# Altium schematic sheet 14-I225-Main.SchDoc
size A; SheetNumber: 14; SheetTotal: 16
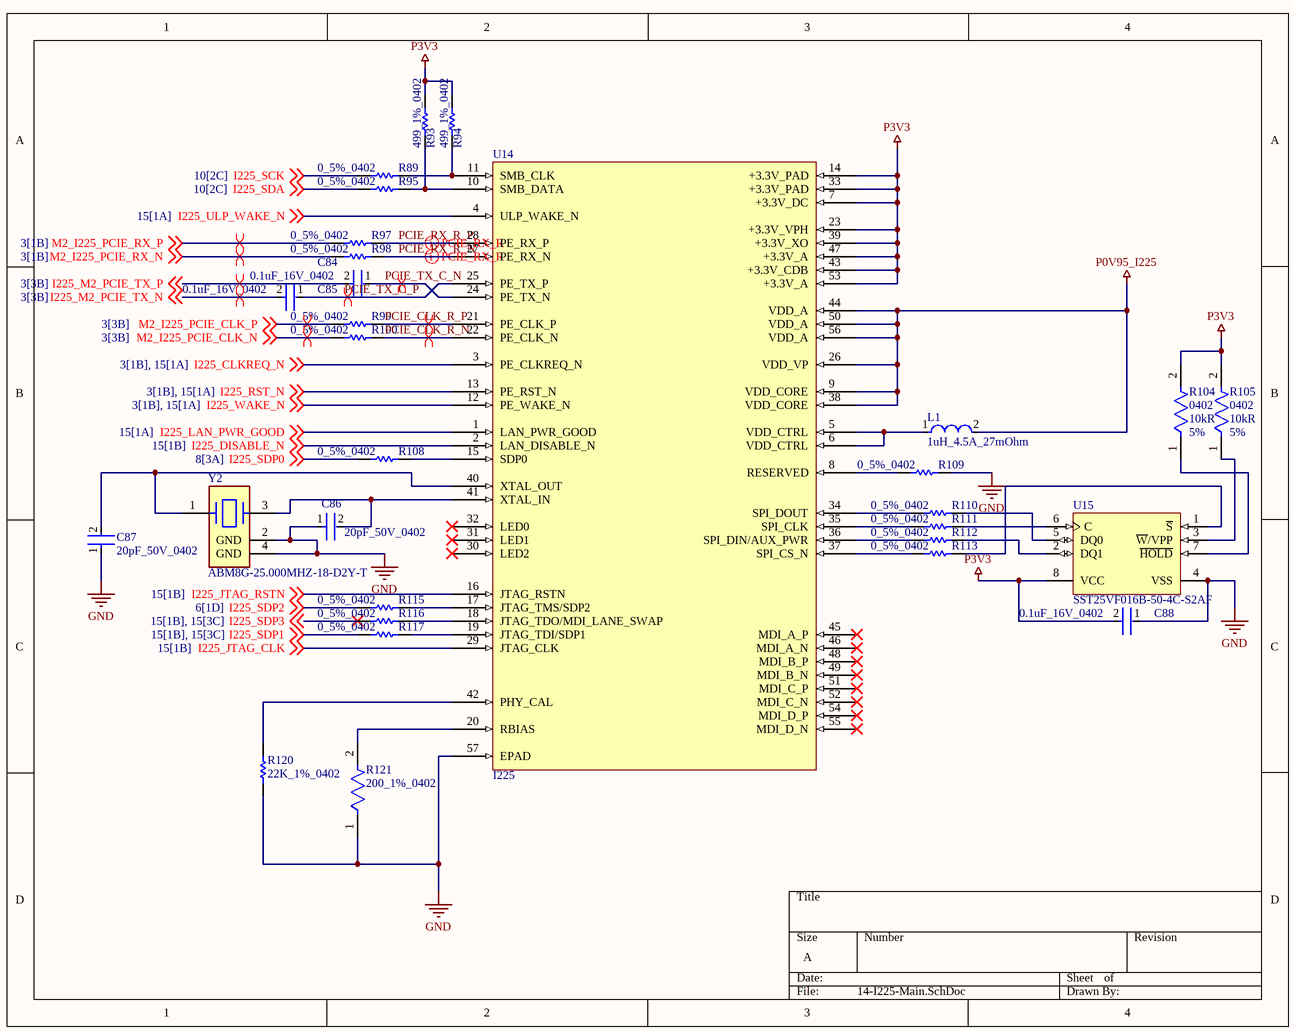
[diagram p0: 14-I225-Main.SchDoc]

## Parts
C84  0.1uF_16V_0402  [FP-GRM15-MFG]
C85  0.1uF_16V_0402  [FP-GRM15-MFG]
C86  20pF_50V_0402  [FP-C0402-BB-MFG]
C87  20pF_50V_0402  [FP-C0402-BB-MFG]
C88  0.1uF_16V_0402  [FP-GRM15-MFG]
L1  1uH_4.5A_27mOhm  [FP-IHLP-1616BZ-FP_1_8545x-MFG]
R89  0_5%_0402  [RESC1005X40X25LL10T10]
R93  499_1%_0402  [RESC1005X40X25LL05T05]
R94  499_1%_0402  [RESC1005X40X25LL05T05]
R95  0_5%_0402  [RESC1005X40X25LL10T10]
R97  0_5%_0402  [RESC1005X40X25LL10T10]
R98  0_5%_0402  [RESC1005X40X25LL10T10]
R99  0_5%_0402  [RESC1005X40X25LL10T10]
R100  0_5%_0402  [RESC1005X40X25LL10T10]
R104  Case/Package: 0402  Resistance: 10kR  Tolerance: 5%  [FP-CRCW0402-e3-IPC_B]  (hidden comment: CRCW040210K0JNED)
R105  Case/Package: 0402  Resistance: 10kR  Tolerance: 5%  [FP-CRCW0402-e3-IPC_B]  (hidden comment: CRCW040210K0JNED)
R108  0_5%_0402  [RESC1005X40X25LL10T10]
R109  0_5%_0402  [RESC1005X40X25LL10T10]
R110  0_5%_0402  [RESC1005X40X25LL10T10]
R111  0_5%_0402  [RESC1005X40X25LL10T10]
R112  0_5%_0402  [RESC1005X40X25LL10T10]
R113  0_5%_0402  [RESC1005X40X25LL10T10]
R115  0_5%_0402  [RESC1005X40X25LL10T10]
R116  0_5%_0402  [RESC1005X40X25LL10T10]
R117  0_5%_0402  [RESC1005X40X25LL10T10]
R120  22K_1%_0402  [RESC1005X40X25NL05T05]
R121  200_1%_0402  [FP-CRCW0402-e3-IPC_C]
U14  I225  [I225 QFN56]
U15  SST25VF016B-50-4C-S2AF  [MICT-MW-8_N]
Y2  ABM8G-25.000MHZ-18-D2Y-T  [FP-ABM8G-MFG]

## Nets
GND: C86.1 C87.1 C88.1 R109.2 R120.1 R121.1 U14.57(EPAD) U15.4(VSS) Y2.2(GND) Y2.4(GND)
P0V95_I225: L1.2 U14.9(VDD_CORE) U14.26(VDD_VP) U14.38(VDD_CORE) U14.44(VDD_A) U14.50(VDD_A) U14.56(VDD_A)
P3V3: C88.2 R93.2 R94.2 R104.2 R105.2 U14.7(+3.3V_DC) U14.14(+3.3V_PAD) U14.23(+3.3V_VPH) U14.33(+3.3V_PAD) U14.39(+3.3V_XO) U14.43(+3.3V_CDB) U14.47(+3.3V_A) U14.53(+3.3V_A) U15.8(VCC)
I225_CLKREQ_N: U14.3(PE_CLKREQ_N) ; off-sheet I225_CLKREQ_N
I225_DISABLE_N: U14.2(LAN_DISABLE_N) ; off-sheet I225_DISABLE_N
I225_JTAG_CLK: U14.29(JTAG_CLK) ; off-sheet I225_JTAG_CLK
I225_JTAG_RSTN: U14.16(JTAG_RSTN) ; off-sheet I225_JTAG_RSTN
I225_LAN_PWR_GOOD: U14.1(LAN_PWR_GOOD) ; off-sheet I225_LAN_PWR_GOOD
I225_M2_PCIE_TX_N: C85.2 ; off-sheet I225_M2_PCIE_TX_N
I225_M2_PCIE_TX_P: C84.2 ; off-sheet I225_M2_PCIE_TX_P
I225_RST_N: U14.13(PE_RST_N) ; off-sheet I225_RST_N
I225_SCK: R89.1 ; off-sheet I225_SCK
I225_SDA: R95.1 ; off-sheet I225_SDA
I225_SDP0: R108.1 ; off-sheet I225_SDP0
I225_SDP1: R117.1 ; off-sheet I225_SDP1
I225_SDP2: R115.1 ; off-sheet I225_SDP2
I225_SDP3: R116.1 ; off-sheet I225_SDP3
I225_ULP_WAKE_N: U14.4(ULP_WAKE_N) ; off-sheet I225_ULP_WAKE_N
I225_WAKE_N: U14.12(PE_WAKE_N) ; off-sheet I225_WAKE_N
M2_I225_PCIE_CLK_N: R100.1 ; off-sheet M2_I225_PCIE_CLK_N
M2_I225_PCIE_CLK_P: R99.1 ; off-sheet M2_I225_PCIE_CLK_P
M2_I225_PCIE_RX_N: R98.1 ; off-sheet M2_I225_PCIE_RX_N
M2_I225_PCIE_RX_P: R97.1 ; off-sheet M2_I225_PCIE_RX_P
PCIE_CLK_R_N: R100.2 U14.22(PE_CLK_N)
PCIE_CLK_R_P: R99.2 U14.21(PE_CLK_P)
PCIE_RX_R_N: R98.2 U14.27(PE_RX_N)
PCIE_RX_R_P: R97.2 U14.28(PE_RX_P)
PCIE_TX_C_N: C84.1 U14.24(PE_TX_N)
PCIE_TX_C_P: C85.1 U14.25(PE_TX_P)
NetC86_2: C86.2 U14.41(XTAL_IN) Y2.3
NetC87_2: C87.2 U14.40(XTAL_OUT) Y2.1
NetL1_1: L1.1 U14.5(VDD_CTRL) U14.6(VDD_CTRL)
NetR89_2: R89.2 R94.1 U14.11(SMB_CLK)
NetR93_1: R93.1 R95.2 U14.10(SMB_DATA)
NetR104_1: R104.1 U15.7(~{HOLD})
NetR105_1: R105.1 U15.3(~{W}/VPP)
NetR108_2: R108.2 U14.15(SDP0)
NetR109_1: R109.1 U14.8(RESERVED)
NetR110_1: R110.1 U14.34(SPI_DOUT)
NetR110_2: R110.2 U15.5(DQ0)
NetR111_1: R111.1 U14.35(SPI_CLK)
NetR111_2: R111.2 U15.6(C)
NetR112_1: R112.1 U14.36(SPI_DIN/AUX_PWR)
NetR112_2: R112.2 U15.2(DQ1)
NetR113_1: R113.1 U14.37(SPI_CS_N)
NetR113_2: R113.2 U15.1(~{S})
NetR115_2: R115.2 U14.17(JTAG_TMS/SDP2)
NetR116_2: R116.2 U14.18(JTAG_TDO/MDI_LANE_SWAP)
NetR117_2: R117.2 U14.19(JTAG_TDI/SDP1)
NetR120_2: R120.2 U14.42(PHY_CAL)
NetR121_2: R121.2 U14.20(RBIAS)

Not connected (* = marked no-connect by the designer): U14 30(LED2)* 31(LED1)* 32(LED0)* 45(MDI_A_P)* 46(MDI_A_N)* 48(MDI_B_P)* 49(MDI_B_N)* 51(MDI_C_P)* 52(MDI_C_N)* 54(MDI_D_P)* 55(MDI_D_N)*

## Layout directives
differential pair; differential pair class 85ohm: I225_M2_PCIE_TX_N, I225_M2_PCIE_TX_P, M2_I225_PCIE_RX_N, M2_I225_PCIE_RX_P, PCIE_RX_R_N, PCIE_RX_R_P, PCIE_TX_C_N, PCIE_TX_C_P
differential pair; differential pair class 100ohm: M2_I225_PCIE_CLK_N, M2_I225_PCIE_CLK_P, PCIE_CLK_R_N, PCIE_CLK_R_P

## Library data of the parts
C84 C85 C88 = CMP-2100-03641-2: CAP CER 0.1UF 16V X7R 0402; Manufacturer Part Number: GRM155R71C104KA88D; Manufacturer: Murata; Standoff Height: 0mm; Tolerance: 10%; Voltage Rating: 16Vdc; Material: Ceramic; Capacitance: 0.10μF; Value: 0.10μF; RoHS: TRUE; Temperature Characteristic: X7R; Octopart: https://octopart.com/grm155r71c104ka88d-murata-196880; Digikey Description: CAP CER 0.1UF 16V X7R 0402; Device Class L3: Ceramic Capacitors; Height: 0.55mm; ComponentLink2Description: Datasheet; Temperature Range Low: -55°C; Ipc Land Pattern Name: CAPC10050X219; ComponentLink2URL: https://search.murata.co.jp/Ceramy/image/img/A01X/G101/ENG/GRM155R71H471KA01-01A.pdf; Device Class L1: Passive Components; Lead Free: yes; Category: Cap; Package: GRM15; Temperature: -55°C to +125°C; Device Class L2: Capacitors; Temperature Range High: +125°C; Mouser Description: 0402 0.1 uF 16V ±10 % Tolerance X7R SMT Multilayer Ceramic Capacitor
C86 C87 = CMP-1034-00890-3: CAP CER 20PF 50V 5% NP0 0402; Manufacturer Part Number: C0402C200J5GACTU; Manufacturer: Kemet; Tolerance: 0.05; Material: Ceramic; Temperature Characteristic: C0G; Temperature Coefficient: 15%; Octopart: https://octopart.com/c0402c200j5gactu-kemet-9143900; ComponentLink2Description: Datasheet; RoHS: TRUE; Ipc Land Pattern Name: CAPC10050X50; Temperature: -55°C to +125°C; Lead Free: Yes; Mouser Description: Multilayer Ceramic Capacitors MLCC - SMD/SMT 50volts 20pF C0G 5%; Device Class L1: Passive Components; Category: Cap; Package: C0402-BB; Temperature Range High: +125°C; Voltage Rating: 50 V; Temperature Range Low: -55°C; Device Class L2: Capacitors; Device Class L3: Ceramic Capacitors; Height: 0.55mm; Capacitance: 20 pF; Value: 20 pF; ComponentLink2URL: https://content.kemet.com/datasheets/KEM_C1002_X7R_SMD.pdf; Digikey Description: CAP CER 20PF 50V 5% NP0 0402; Automotive: No
L1 = CMP-02424-000223-1: Fixed Inductors Commercial Low DCR Series SMT 1uH 4.5A 27mΩ 20%; DC Resistance (DCR): 27mR; Core Material: Ferrite; Test Frequency: 100kHz; Shielding: Shielded; Self Resonant Frequency: 64MHz; Saturation Current: 5A; Inductance Tolerance: 20%; Min Operating Temperature: -55°C; Lead Free: Lead Free; Inductance: 1uH; Contact Plating: Tin; Package Quantity: 4000; Military Standard: Not; Depth: 4.31mm; Tolerance: 20%; RMS Current (Irms): 4.5A; Packaging: Tape and Reel; Number of Pins: 1616; Case/Package: 1616; Termination: SMD/SMT; Height: 2mm; Current Rating: 4.5A; Case Code (Metric): 4040; Max Operating Temperature: 125°C; Case Code (Imperial): 1616; Max DC Current: 4.5A; Width: 0.16inch; Mount: Surface Mount; Length: 4.7mm; Radiation Hardening: No; Height - Seated (Max): 0.079inch
R89 R95 R97-R100 R108-R113 R115-R117 = CMP-2002-04569-1: Manufacturer: KOA Speer; Part Number: RK73Z1ETTP
R93 R94 = CMP-2002-00965-1: Manufacturer: Panasonic; Part Number: ERJ-2RKF4990X
R104 R105 = CMP-2002-08136-3: RES Thick Film, 10kΩ, 5%, 0.063W, 200ppm/°C, 0402; Voltage Rating: 50V; Power Rating: 63mW; Military Standard: Not; Packaging: Tape and Reel; Case Code (Imperial): 0402; Min Operating Temperature: -55°C; Case Code (Metric): 1005; Temperature Coefficient: 200ppm/°C; Termination: SMD/SMT; Composition: Thick Film; Depth: 0.5mm; Number of Terminations: 2; Contact Plating: Tin; Height: 0.016inch; Width: 0.5mm; Max Operating Temperature: 155°C; Features: Automotive AEC-Q200; Length: 1mm; Radiation Hardening: No; Max Power Dissipation: 63mW; Mount: Surface Mount; Package Quantity: 1; Weight: 2.3E-05oz
R120 = CMP-1011-00659-2: Part Number: CRCW040222K0FKED; Manufacturer: Vishay Dale
R121 = CMP-1011-00429-3: RES Thick Film, 200Ω, 1%, 0.063W, 100ppm/°C, 0402; Max Power Dissipation: 63mW; Voltage Rating: 50V; Resistance: 200R; Termination: SMD/SMT; Weight: 2.3E-05oz; Case/Package: 0402; Contact Plating: Tin; Number of Pins: 2; Width: 0.5mm; Height: 0.35mm; Case Code (Metric): 1005; Military Standard: Not; Features: Automotive AEC-Q200; Power Rating: 63mW; Temperature Coefficient: 100ppm/°C; Tolerance: 1%; Lead Free: Lead Free; Depth: 0.5mm; Max Operating Temperature: 155°C; Min Operating Temperature: -55°C; Package Quantity: 10; Voltage Rating (DC): 50V; Composition: Thick Film; Mount: Surface Mount; Radiation Hardening: No; Length: 1mm; Packaging: Tape and Reel; Number of Terminations: 2; Case Code (Imperial): 0402
U15 = CMP-0357-00138-1: 16 Mb (x1/x2) Serial NOR Flash Memory with Dual I/O, 75 MHz, 2.3 to 3.6 V, 8-pin SO8 Wide (MW), Tube; Part Family: SST25; Manufacturer: Microchip; Density: 16MbÂ; Voltage: 2.3V-3.6VÂ; Speed: 75 MHzÂ; Mounting Technology: Surface Mount; Part Status: ProductionÂ; Type: Dual I/OÂ; ComponentLink3URL: https://ww1.microchip.com/downloads/en/DeviceDoc/20005044C.pdf; PartNumber: SST25VF016B-50-4C-S2AF; PackageVersion: Rev 8; ComponentLink2Description: Datasheet; ComponentLink3Description: Package Specification; PackageDescription: 8-Pin SO Wide, 5.62 X 6.05 mm, Pitch 1.27 mm; Applications: EmbeddedÂ; PackageReference: MICT-MW-8; RoHS: YesÂ; ComponentLink1URL: https://ww1.microchip.com/downloads/en/DeviceDoc/20005044C.pdf; ComponentLink1Description: Manufacturer; Width: x1/x2Â; ComponentLink2URL: https://ww1.microchip.com/downloads/en/DeviceDoc/20005044C.pdf; Package: SO8 WideÂ; DatasheetVersion: Rev. 8
Y2 = CMP-2000-05733-2: CRYSTAL 25.0000MHZ 18PF SMD; Manufacturer: Abracon; Stability: 30ppm; Frequency: 25MHz; Esr: 60Ω; Tolerance: 20ppm; Automotive: No; Series: ABM8G; Temperature Range High: +85°C; ComponentLink2URL: https://abracon.com/Resonators/ABM8G.pdf; RoHS: TRUE; Octopart: https://octopart.com/abm8g-25.000mhz-18-d2y-t-abracon-12676602; Package: ABM8G; Category: Crys; Device Class L2: Crystals / Oscillators; ComponentLink2Description: Datasheet; Manufacturer Part Number: ABM8G-25.000MHZ-18-D2Y-T; Height: 1mm; Lead Free: Yes; Digikey Description: CRYSTAL 25.0000MHZ 18PF SMD; Temperature Range Low: -40°C; Device Class L3: Crystals; Load Capacitance: 18pF; Temperature: -40°C to +85°C; Device Class L1: Passive Components; Mouser Description: Crystals 25.000MHz 18pF 30ppm -40C +85C